# Altium project ALT_AVR-TESTER.PrjPcb
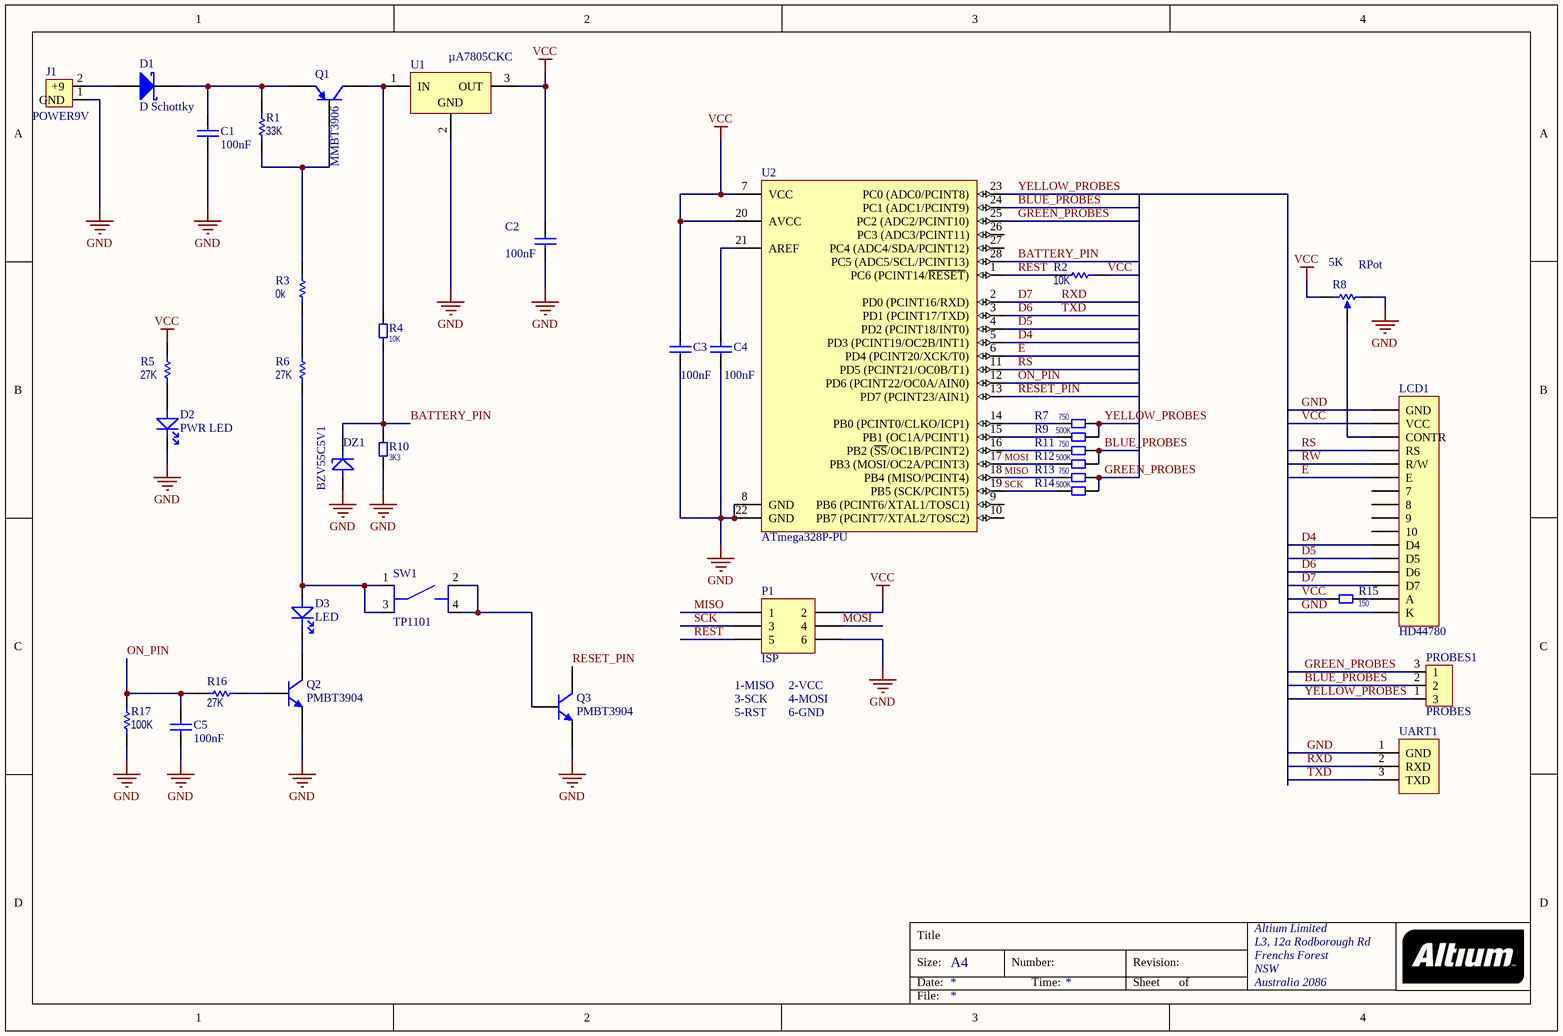
[diagram p0: SHEET_AVR-TEST.SchDoc]
1 sheet, 37 parts. Net scope: global (net labels, ports and power ports of the same name join across sheets).
Board files: ALT-AVR-TESTER-MINI.PcbDoc, PRN_ALT-AVR-TESTER-MINI.PcbDoc, TESTER-1602.PcbDoc

## Sheet SHEET_AVR-TEST.SchDoc
size A4; Organization: Altium Limited; Address1: L3, 12a Rodborough Rd; Address2: Frenchs Forest; Address3: NSW; Address4: Australia 2086

### Parts
C1  100nF  [C1206]
C2  100nF  [C1206]
C3  100nF  [C1206]
C4  100nF  [C1206]
C5  100nF  [C1206]
D1  D Schottky  [SMB]
D2  PWR LED  [LED_254]
D3  LED  [LED_254]
DZ1  BZV55C5V1  [SOD80D]
J1  POWER9V  [TB2-5MM]
LCD1  HD44780  [HDR1X16]
P1  ISP  [HDR2X3]
PROBES1  PROBES  [TB3-5MM]
Q1  MMBT3906  [SOT23_N]
Q2  PMBT3904  [SOT23_N]
Q3  PMBT3904  [SOT23_N]
R1  value 33K  [R0805]  (hidden comment: ERQF06)
R2  value 10K  [RC0805DS]  (hidden comment: ERQF06)
R3  value 0k  [R0805]  (hidden comment: ERQF06)
R4  10K  [R0805]
R5  value 27K  [r0805]  (hidden comment: ERQF06)
R6  value 27K  [R0805]  (hidden comment: ERQF06)
R7  750  [R0805]
R8  RPot  value 5K  [VR5]
R9  500K  [R0805]
R10  3K3  [R0805]
R11  750  [R0805]
R12  500K  [R0805]
R13  750  [R0805]
R14  500K  [R0805]
R15  150  [R0805]
R16  value 27K  [R0805]  (hidden comment: ERQF06)
R17  value 100K  [R0805]  (hidden comment: ERQF06)
SW1  TP1101  [SW TP1101]
U1  µA7805CKC  [TO-92]
U2  ATmega328P-PU  [28P3]
UART1  Header 3  [HDR1X3]  (value not drawn)

### Nets
GND: C1.1 C2.1 C3.1 C4.1 C5.1 D2.2 DZ1.1 J1.1(GND) LCD1.1(GND) LCD1.16(K) P1.6 Q2.2(E) Q3.2(E) R8.2(BOT) R10.2 R17.1 U1.2(GND) U2.8(GND) U2.22(GND) UART1.1(GND)
VCC: C2.2 C3.2 LCD1.2(VCC) P1.2 R2.1 R5.2 R8.1(TOP) R15.1 U1.3(OUT) U2.7(VCC) U2.20(AVCC)
BATTERY_PIN: DZ1.2 R4.2 R10.1 U2.28(PC5_(ADC5/SCL/PCINT13))
BLUE_PROBES: PROBES1.2 R11.2 R12.2 U2.24(PC1_(ADC1/PCINT9))
D4: LCD1.11(D4) U2.5(PD3_(PCINT19/OC2B/INT1))
D5: LCD1.12(D5) U2.4(PD2_(PCINT18/INT0))
D6: LCD1.13(D6) U2.3(PD1_(PCINT17/TXD)) UART1.3(TXD)  [also labelled TXD]
D7: LCD1.14(D7) U2.2(PD0_(PCINT16/RXD)) UART1.2(RXD)  [also labelled RXD]
E: LCD1.6(E) U2.6(PD4_(PCINT20/XCK/T0))
GREEN_PROBES: PROBES1.3(1) R13.2 R14.2 U2.25(PC2_(ADC2/PCINT10))
MISO: P1.1 R13.1 U2.18(PB4_(MISO/PCINT4))
MOSI: P1.4 R12.1 U2.17(PB3_(MOSI/OC2A/PCINT3))
ON_PIN: C5.2 R16.2 R17.2 U2.12(PD6_(PCINT22/OC0A/AIN0))
RESET_PIN: Q3.3(C) U2.13(PD7_(PCINT23/AIN1))
REST: P1.5 R2.2 U2.1(PC6_(PCINT14/~{RESET}))
RS: LCD1.4(RS) U2.11(PD5_(PCINT21/OC0B/T1))
RW: LCD1.5(R/W)
SCK: P1.3 R14.1 U2.19(PB5_(SCK/PCINT5))
YELLOW_PROBES: PROBES1.1(3) R7.2 R9.2 U2.23(PC0_(ADC0/PCINT8))
NetC1_2: C1.2 D1.2(K) Q1.2(E) R1.2
NetC4_2: C4.2 U2.21(AREF)
NetD1_1: D1.1(A) J1.2(+9)
NetD2_1: D2.1 R5.1
NetD3_1: D3.1 R6.1 SW1.1 SW1.3
NetD3_2: D3.2 Q2.3(C)
NetLCD1_3: LCD1.3(CONTR) R8.3(TAP)
NetLCD1_15: LCD1.15(A) R15.2
NetQ1_1: Q1.1(B) R1.1 R3.2
NetQ1_3: Q1.3(C) R4.1 U1.1(IN)
NetQ2_1: Q2.1(B) R16.1
NetQ3_1: Q3.1(B) SW1.2 SW1.4
NetR3_1: R3.1 R6.2
NetR7_1: R7.1 U2.14(PB0_(PCINT0/CLKO/ICP1))
NetR9_1: R9.1 U2.15(PB1_(OC1A/PCINT1))
NetR11_1: R11.1 U2.16(PB2_(~{SS}/OC1B/PCINT2))

Not connected (* = marked no-connect by the designer): LCD1 7 8 9 10; U2 9(PB6_(PCINT6/XTAL1/TOSC1)) 10(PB7_(PCINT7/XTAL2/TOSC2)) 26(PC3_(ADC3/PCINT11)) 27(PC4_(ADC4/SDA/PCINT12))

### Notes on the sheet
- (near P1) 1-MISO
- 3-SCK
- 5-RST
- (near P1) 2-VCC
- 4-MOSI
- 6-GND
- Title
- Size:
- Date:
- A4
- Number:
- Time:
- Revision:
- Sheet
- of
- File:

### Library data of the parts
C1-C5 = CAP 0805 NP0: SMD Конденсатор 0805 NP0 25V; Корпус: 0805; Mfg: kemet; Упаковка: лента; Поставщик: Temys; SMD_DIP: SMD; Precision: NP0; DataSheet: www.kemet.com/kemet/web/homepage/kechome.nsf/weben/BCF368A46664BBED852572AD00583CC9/$file/F3102.pdf; Value: 100nF
D1 = D Schottky: Schottky Diode; Published: 8-Jun-2000; LatestRevisionDate: 17-Jul-2002; LatestRevisionNote: Re-released for DXP Platform.; PackageReference: SMB; Publisher: Altium Limited; PackageDescription: DO-214-AA/SMB; 2 C-Bend Leads; Body 5.3 x 3.6 mm, inc. leads (LxW); Code_JEDEC: DO-214-AA
D2 D3 = LED: Упаковка: туб лента поддон; SMD_DIP: SMD_DIP; Корпус: *
DZ1 = DZ BZV55C5V1: SMD SILICON ZENER DIODE 0.5 WATT ± 5% TOLERANCE; Корпус: SOD80; Mfg: microsemi; Упаковка: лента; Поставщик: Temys; Value: 5.1V; SMD_DIP: SMD; Precision: 5%; PartNumber: BZV55C5V1; DataSheet: www.microsemi.com/datasheets/BZV55_C2V4_C75.pdf
J1 = CON2: Упаковка: туб лента поддон; SMD_DIP: SMD_DIP; Корпус: *
LCD1 = MHDR1X16: Header, 16-Pin; LatestRevisionDate: 17-Jul-2002; LatestRevisionNote: Re-released for DXP Platform.; Publisher: Altium Limited
P1 = Header 3X2H: Header, 3-Pin, Dual row, Right Angle; LatestRevisionDate: 17-Jul-2002; LatestRevisionNote: Re-released for DXP Platform.; Publisher: Altium Limited
PROBES1 = CON TBN050-D10-03: Клемник на плату прямой шаг5мм; PartNumber: TBN050-D10-03 (TB-03); SMD_DIP: DIP; Mfg: MoreThanAll; Примечание: Возможная замена DG301-03P-12; Поставщик: Temys; DataSheet: www.morethanall.com.tw/MoreThanAll.NET/Drawing/TBN050-D10-xx.pdf
Q1 = MMBT3906: PNP Switching Transistor; Published: 17-Sep-2003; LatestRevisionDate: 12-Dec-2006; LatestRevisionNote: IPC-7351 Footprint Added.; DatasheetVersion: 11-Apr-2000; PackageVersion: May-1999; PackageReference: SOT23; Publisher: Altium Limited; PackageDescription: 3-Pin SOT-23 Package 0.95 mm Pitch, 2.3 mm Lead Span; ComponentLink1Description: Manufacturer Link; ComponentLink1URL: http://www.semiconductors.philips.com/; ComponentLink2Description: Datasheet; ComponentLink2URL: http://www.semiconductors.philips.com/acrobat/datasheets/MMBT3906_2.pdf
Q2 Q3 = PMBT3904: NPN Switching Transistor; Published: 17-Sep-2003; LatestRevisionDate: 12-Dec-2006; LatestRevisionNote: IPC-7351 Footprint Added.; DatasheetVersion: 27-Apr-1999; PackageVersion: May-1999; PackageReference: SOT23; Publisher: Altium Limited; PackageDescription: 3-Pin SOT-23 Package 0.95 mm Pitch, 2.3 mm Lead Span; ComponentLink1Description: Manufacturer Link; ComponentLink1URL: http://www.semiconductors.philips.com/; ComponentLink2Description: Datasheet; ComponentLink2URL: http://www.semiconductors.philips.com/acrobat/datasheets/PMBT3904_4.pdf
R1-R3 R5 R6 R16 R17 = ERQF06: Flat Chip Fuse Resistor, 0.47 Ohm to 10 Ohm Range, 5% Tolerance, 0805 Size, 0.1 W; Note: If flow soldering, adjust pad width of PCB Footprint to 0.7 - 0.8 times the width of the resistor.; Published: 17-Dec-2003; LatestRevisionDate: 19-Mar-2004; LatestRevisionNote: Silkscreen size reduced.; PackageDocument: Mar-2003; PackageReference: 6-0805; Publisher: Altium Limited; Code_IPC: 2012 [0805]; ComponentLink1Description: Manufacturer Link; ComponentLink1URL: http://www.panasonic.com/industrial/components/resistive_products.htm; ComponentLink2Description: Datasheet; ComponentLink2URL: http://www.panasonic.com/industrial/components/pdf/AOB0000CE1.pdf
R4 R7 R9-R15 = RES 0805: SMD Резистор 0805; Корпус: 0805; Precision: 5%; Упаковка: лента; Поставщик: Temys; SMD_DIP: SMD
  R4: Value: 10K
  R7 R11 R13: Value: 750
  R9 R12 R14: Value: 500K
  R10: Value: 3K3
  R15: Value: 150
R8 = RPot: Potentiometer; Sim Note: Enter the Resistance value and the set point into parameter fields.; Set Position: 0.5; Published: 8-Jun-2000; LatestRevisionDate: 17-Jul-2002; LatestRevisionNote: Re-released for DXP Platform.; PackageReference: VR5; Publisher: Altium Limited; PackageDescription: Variable Resistor, Thru-Hole; 3 Leads
SW1 = SW TP1101: Кнопка; SMD_DIP: DIP; Корпус: 4.3mm; Mfg: amegatech; Поставщик: Temys; PartNumber: TP1101; DataSheet: www.amegatech.co.kr/docs/pro-do/tp1101.gif
U1 = µA7805CKC: Positive-Voltage Regulator; Note: Pin 2 is electrically connected to TAB.; Published: 15-Apr-2002; DatasheetVersion: Jul-1999; PackageVersion: Sep-1995; PackageReference: KC03; Publisher: Altium Limited; PackageDescription: TO, Thru-Hole, Vertical, Heatsink Mounted; 3 In-Line Leads; Pitch 2.54 mm; ComponentLink1Description: Manufacturer Link; ComponentLink1URL: http://www.ti.com/; ComponentLink2Description: Datasheet; ComponentLink2URL: http://www-s.ti.com/sc/ds/ua7805.pdf
U2 = ATmega328P-PU: 8-bit AVR Microcontroller, 32KB Flash, 1KB EEPROM, 2KB SRAM, 28-pin PDIP, Industrial Grade (-40°C to 85°C); Published: 1-Apr-2010; DatasheetVersion: revA, Jan-2010; PackageVersion: revB, Sep-2001; PackageReference: 28P3; Publisher: Altium Limited; PackageDescription: 28-lead (0.300"/7.62mm Wide) Plastic Dual Inline Package (PDIP); Supplier 1: Digi-Key; Supplier Part Number 1: ATMEGA328P-PU-ND; Supplier 2: Farnell; Supplier Part Number 2: 1715487; Supplier 3: Mouser; Supplier Part Number 3: 556-ATMEGA328P-PU; ComponentLink1Description: Manufacturer Link; ComponentLink1URL: http://www.atmel.com/products/avr/default.asp?; ComponentLink2Description: ATmega48A/48PA/88A/88PA/168A/168PA/328/328P Datasheet; ComponentLink2URL: http://www.atmel.com/dyn/resources/prod_documents/8271.pdf; ComponentLink3Description: ATmega48A/48PA/88A/88PA/168A/168PA/328/328P Summary; ComponentLink3URL: http://www.atmel.com/dyn/resources/prod_documents/8271S.pdf; ComponentLink4Description: Atmel.com Home; ComponentLink4URL: http://www.atmel.com
UART1 = Header 3: Header, 3-Pin; LatestRevisionDate: 17-Jul-2002; LatestRevisionNote: Re-released for DXP Platform.; Publisher: Altium Limited